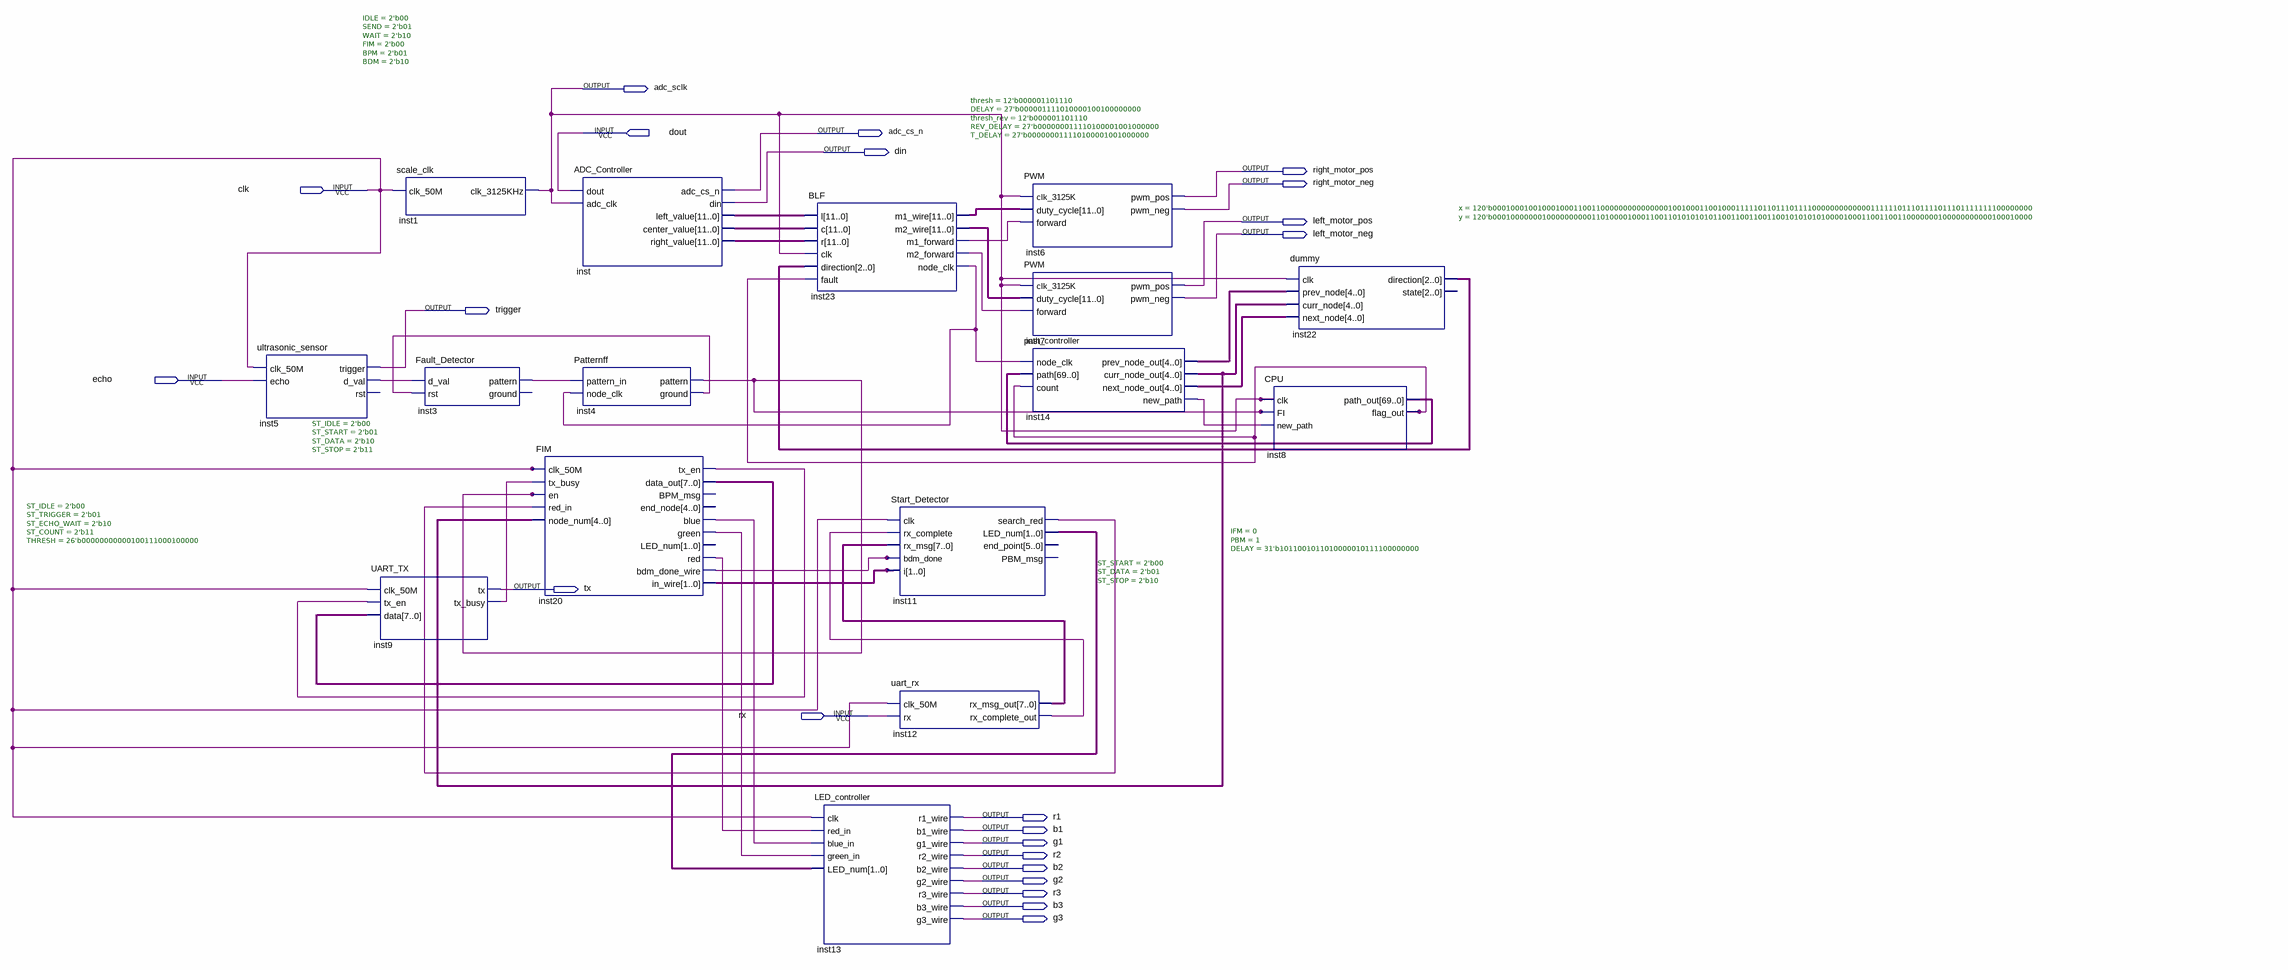
[diagram p0: schematic sheet]
// Quartus schematic BLF_complete.bdf as structural Verilog: 16 symbols, 22 pins
module BLF_complete (
  input  dout,
  input  clk,
  input  echo,
  input  rx,
  output adc_sclk,
  output adc_cs_n,
  output din,
  output right_motor_pos,
  output right_motor_neg,
  output left_motor_pos,
  output left_motor_neg,
  output trigger,
  output tx,
  output r1,
  output b1,
  output g1,
  output r2,
  output b2,
  output g2,
  output r3,
  output b3,
  output g3
);

  wire inst3_pattern, inst4_ground, inst4_pattern, inst5_d_val, inst8_flag_out, inst9_tx_busy,
       inst11_search_red, inst12_rx_complete_out, inst14_new_path, inst20_bdm_done_wire, inst20_blue,
       inst20_green, inst20_red, inst20_tx_en, inst23_m1_forward, inst23_m2_forward, inst23_node_clk;
  wire [1:0] inst11_led_num, inst20_in_wire;
  wire [2:0] inst22_direction;
  wire [4:0] inst14_curr_node_out, inst14_next_node_out, inst14_prev_node_out;
  wire [7:0] inst12_rx_msg_out, inst20_data_out;
  wire [11:0] inst23_m1_wire, inst23_m2_wire, inst_center_value, inst_left_value, inst_right_value;
  wire [69:0] inst8_path_out;

  ultrasonic_sensor #(.ST_IDLE(2'b00), .ST_TRIGGER(2'b01), .ST_ECHO_WAIT(2'b10), .ST_COUNT(2'b11), .THRESH(26'b00000000000100111000100000)) inst5 (
    .clk_50M(clk), .echo(echo), .trigger(trigger), .d_val(inst5_d_val));  // open: rst
  UART_TX #(.ST_IDLE(2'b00), .ST_START(2'b01), .ST_DATA(2'b10), .ST_STOP(2'b11)) inst9 (
    .clk_50M(clk), .tx_en(inst20_tx_en), .data(inst20_data_out), .tx(tx), .tx_busy(inst9_tx_busy));
  scale_clk inst1 (.clk_50M(clk), .clk_3125KHz(adc_sclk));
  Fault_Detector inst3 (.d_val(inst5_d_val), .rst(inst4_ground), .pattern(inst3_pattern));  // open: ground
  FIM #(.IDLE(2'b00), .SEND(2'b01), .WAIT(2'b10), .FIM(2'b00), .BPM(2'b01), .BDM(2'b10)) inst20 (
    .clk_50M(clk), .tx_busy(inst9_tx_busy), .en(inst4_pattern), .red_in(inst11_search_red),
    .node_num(inst14_curr_node_out), .tx_en(inst20_tx_en), .data_out(inst20_data_out), .blue(inst20_blue),
    .green(inst20_green), .red(inst20_red), .bdm_done_wire(inst20_bdm_done_wire), .in_wire(inst20_in_wire));  // open: BPM_msg, end_node, LED_num
  ADC_Controller inst (
    .dout(dout), .adc_clk(adc_sclk), .adc_cs_n(adc_cs_n), .din(din), .left_value(inst_left_value),
    .center_value(inst_center_value), .right_value(inst_right_value));
  Patternff inst4 (
    .pattern_in(inst3_pattern), .node_clk(inst23_node_clk), .pattern(inst4_pattern), .ground(inst4_ground));
  BLF #(.thresh(12'b000001101110), .DELAY(27'b000001111010000100100000000), .thresh_rev(12'b000001101110), .REV_DELAY(27'b000000011110100001001000000), .T_DELAY(27'b000000011110100001001000000)) inst23 (
    .l(inst_left_value), .c(inst_center_value), .r(inst_right_value), .clk(adc_sclk),
    .direction(inst22_direction), .fault(inst8_flag_out), .m1_wire(inst23_m1_wire), .m2_wire(inst23_m2_wire),
    .m1_forward(inst23_m1_forward), .m2_forward(inst23_m2_forward), .node_clk(inst23_node_clk));
  LED_controller inst13 (
    .clk(clk), .red_in(inst20_red), .blue_in(inst20_blue), .green_in(inst20_green), .LED_num(inst11_led_num),
    .r1_wire(r1), .b1_wire(b1), .g1_wire(g1), .r2_wire(r2), .b2_wire(b2), .g2_wire(g2), .r3_wire(r3),
    .b3_wire(b3), .g3_wire(g3));
  Start_Detector #(.IFM(0), .PBM(1), .DELAY(31'b1011001011010000010111100000000)) inst11 (
    .clk(clk), .rx_complete(inst12_rx_complete_out), .rx_msg(inst12_rx_msg_out),
    .bdm_done(inst20_bdm_done_wire), .i(inst20_in_wire), .search_red(inst11_search_red),
    .LED_num(inst11_led_num));  // open: end_point, PBM_msg
  uart_rx #(.ST_START(2'b00), .ST_DATA(2'b01), .ST_STOP(2'b10)) inst12 (
    .clk_50M(clk), .rx(rx), .rx_msg_out(inst12_rx_msg_out), .rx_complete_out(inst12_rx_complete_out));
  PWM inst6 (
    .clk_3125K(adc_sclk), .duty_cycle(inst23_m1_wire), .forward(inst23_m1_forward),
    .pwm_pos(right_motor_pos), .pwm_neg(right_motor_neg));
  PWM inst7 (
    .clk_3125K(adc_sclk), .duty_cycle(inst23_m2_wire), .forward(inst23_m2_forward), .pwm_pos(left_motor_pos),
    .pwm_neg(left_motor_neg));
  path_controller inst14 (
    .node_clk(inst23_node_clk), .path(inst8_path_out), .count(inst8_flag_out),
    .prev_node_out(inst14_prev_node_out), .curr_node_out(inst14_curr_node_out),
    .next_node_out(inst14_next_node_out), .new_path(inst14_new_path));
  dummy #(.x(120'b000100010010001000110011000000000000000100100011001000111110110111011110000000000000111111011101111011101111111100000000), .y(120'b000100000001000000000011010000100011001101010101011001100110011001010101010000100011001100110000000100000000000100010000)) inst22 (
    .clk(adc_sclk), .prev_node(inst14_prev_node_out), .curr_node(inst14_curr_node_out),
    .next_node(inst14_next_node_out), .direction(inst22_direction));  // open: state
  CPU inst8 (
    .clk(adc_sclk), .FI(inst4_pattern), .new_path(inst14_new_path), .path_out(inst8_path_out),
    .flag_out(inst8_flag_out));
endmodule
